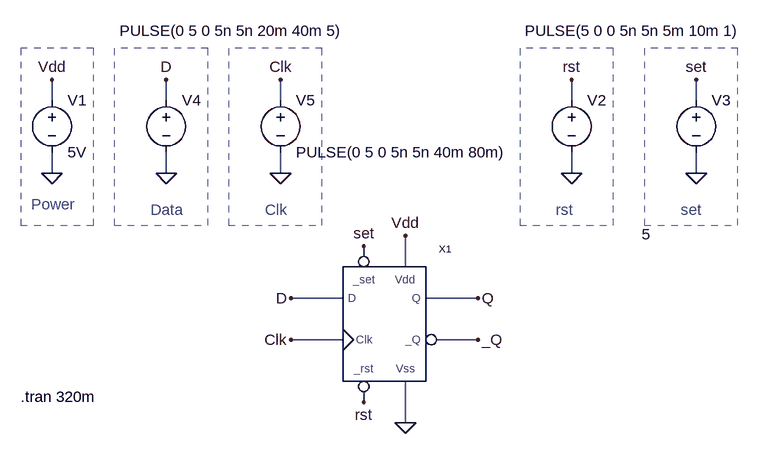
[diagram p0: schematic dff_p_w_asy_rst_set_block.asc]
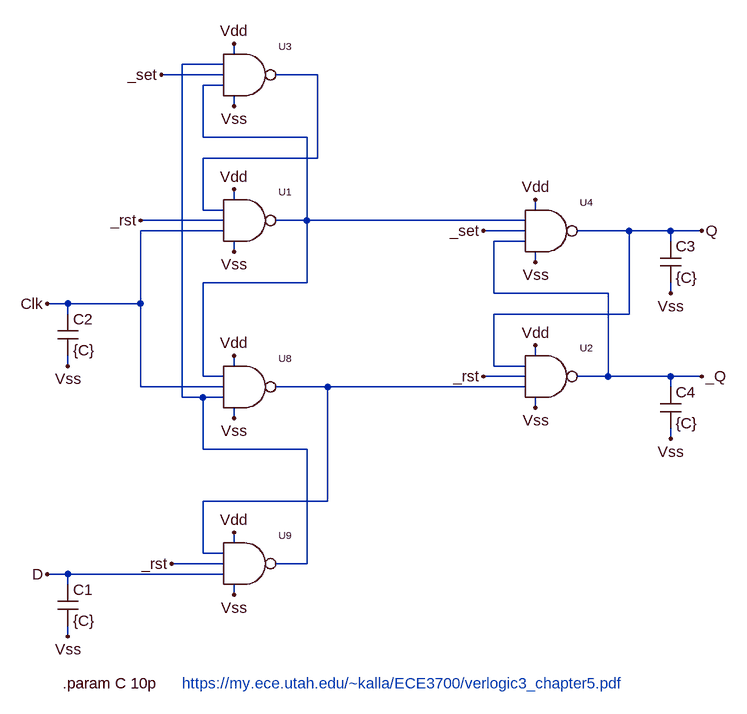
[diagram p1: sub-circuit dff_p_w_asy_rst_set.asc]
dff_p_w_asy_rst_set_block.asc, the LTspice schematic file:
Version 4
SHEET 1 896 680
WIRE -560 -416 -560 -448
WIRE -384 -416 -384 -448
WIRE -208 -416 -208 -448
WIRE 240 -416 240 -448
WIRE 432 -416 432 -448
WIRE -560 -304 -560 -336
WIRE -384 -304 -384 -336
WIRE -208 -304 -208 -336
WIRE 240 -304 240 -336
WIRE 432 -304 432 -336
WIRE -80 -176 -80 -192
WIRE -16 -160 -16 -208
WIRE -112 -112 -192 -112
WIRE 96 -112 16 -112
WIRE -112 -48 -192 -48
WIRE 96 -48 32 -48
WIRE -80 48 -80 32
WIRE -16 80 -16 16
FLAG 96 -112 Q
FLAG -192 -112 D
FLAG -16 -208 Vdd
FLAG -16 80 0
FLAG -560 -304 0
FLAG -560 -448 Vdd
FLAG -192 -48 Clk
FLAG 96 -48 _Q
FLAG -384 -304 0
FLAG -384 -448 D
FLAG -208 -304 0
FLAG -208 -448 Clk
FLAG 240 -304 0
FLAG 240 -448 rst
FLAG -80 48 rst
FLAG 432 -304 0
FLAG 432 -448 set
FLAG -80 -192 set
SYMBOL voltage -560 -432 R0
WINDOW 123 0 0 Left 0
WINDOW 39 0 0 Left 0
SYMATTR InstName V1
SYMATTR Value 5V
SYMBOL voltage -384 -432 R0
WINDOW 123 0 0 Left 0
WINDOW 39 0 0 Left 0
WINDOW 3 -72 -91 Left 2
SYMATTR Value PULSE(0 5 0 5n 5n 20m 40m 5)
SYMATTR InstName V4
SYMBOL voltage -208 -432 R0
WINDOW 123 0 0 Left 0
WINDOW 39 0 0 Left 0
SYMATTR InstName V5
SYMATTR Value PULSE(0 5 0 5n 5n 40m 80m)
SYMBOL voltage 240 -432 R0
WINDOW 123 0 0 Left 0
WINDOW 39 0 0 Left 0
WINDOW 3 -72 -91 Left 2
SYMATTR Value PULSE(5 0 0 5n 5n 5m 10m 1)
SYMATTR InstName V2
SYMBOL voltage 432 -432 R0
WINDOW 123 0 0 Left 0
WINDOW 39 0 0 Left 0
WINDOW 3 -84 222 Left 2
SYMATTR Value 5
SYMATTR InstName V3
SYMBOL dff_p_w_asy_rst_set -112 16 R0
SYMATTR InstName X1
TEXT -592 -256 Left 2 ;Power
TEXT -608 40 Left 2 !.tran 320m
TEXT -408 -248 Left 2 ;Data
TEXT -232 -248 Left 2 ;Clk
TEXT 216 -248 Left 2 ;rst
TEXT 408 -248 Left 2 ;set
RECTANGLE Normal -496 -496 -608 -224 2
RECTANGLE Normal -320 -496 -464 -224 2
RECTANGLE Normal -144 -496 -288 -224 2
RECTANGLE Normal 304 -496 160 -224 2
RECTANGLE Normal 496 -496 352 -224 2

dff_p_w_asy_rst_set.asc, the sub-circuit schematic file:
Version 4
SHEET 1 880 680
WIRE -464 -720 -464 -736
WIRE -480 -704 -544 -704
WIRE -480 -688 -576 -688
WIRE -336 -688 -400 -688
WIRE -480 -672 -512 -672
WIRE -464 -640 -464 -656
WIRE -512 -592 -512 -672
WIRE -352 -592 -512 -592
WIRE -336 -560 -336 -688
WIRE -336 -560 -512 -560
WIRE -464 -496 -464 -512
WIRE -512 -480 -512 -560
WIRE -480 -480 -512 -480
WIRE 0 -480 0 -496
WIRE -480 -464 -608 -464
WIRE -352 -464 -352 -592
WIRE -352 -464 -400 -464
WIRE -16 -464 -352 -464
WIRE -480 -448 -608 -448
WIRE -16 -448 -80 -448
WIRE 144 -448 64 -448
WIRE 208 -448 144 -448
WIRE 256 -448 208 -448
WIRE -16 -432 -64 -432
WIRE 208 -432 208 -448
WIRE -464 -416 -464 -432
WIRE 0 -400 0 -416
WIRE -352 -368 -352 -464
WIRE -352 -368 -512 -368
WIRE -64 -352 -64 -432
WIRE 112 -352 -64 -352
WIRE 208 -352 208 -368
WIRE -720 -336 -752 -336
WIRE -608 -336 -608 -448
WIRE -608 -336 -720 -336
WIRE -720 -320 -720 -336
WIRE 144 -320 144 -448
WIRE 144 -320 -64 -320
WIRE 0 -256 0 -272
WIRE -720 -240 -720 -256
WIRE -464 -240 -464 -256
WIRE -64 -240 -64 -320
WIRE -16 -240 -64 -240
WIRE -512 -224 -512 -368
WIRE -480 -224 -512 -224
WIRE -16 -224 -80 -224
WIRE 112 -224 112 -352
WIRE 112 -224 64 -224
WIRE 208 -224 112 -224
WIRE 256 -224 208 -224
WIRE -608 -208 -608 -336
WIRE -480 -208 -608 -208
WIRE -320 -208 -400 -208
WIRE -16 -208 -320 -208
WIRE 208 -208 208 -224
WIRE -544 -192 -544 -704
WIRE -512 -192 -544 -192
WIRE -480 -192 -512 -192
WIRE 0 -176 0 -192
WIRE -464 -160 -464 -176
WIRE 208 -128 208 -144
WIRE -512 -112 -512 -192
WIRE -352 -112 -512 -112
WIRE -320 -32 -320 -208
WIRE -320 -32 -512 -32
WIRE -464 32 -464 16
WIRE -512 48 -512 -32
WIRE -480 48 -512 48
WIRE -480 64 -560 64
WIRE -352 64 -352 -112
WIRE -352 64 -400 64
WIRE -720 80 -752 80
WIRE -480 80 -720 80
WIRE -720 96 -720 80
WIRE -464 112 -464 96
WIRE -720 176 -720 160
FLAG -464 16 Vdd
FLAG 0 -496 Vdd
FLAG -464 -256 Vdd
FLAG -464 -160 Vss
FLAG -464 112 Vss
FLAG 0 -400 Vss
FLAG -752 -336 Clk
FLAG -752 80 D
FLAG 256 -448 Q
FLAG 256 -224 _Q
FLAG -464 -736 Vdd
FLAG -464 -416 Vss
FLAG 0 -272 Vdd
FLAG -464 -640 Vss
FLAG -464 -512 Vdd
FLAG 0 -176 Vss
FLAG -720 -240 Vss
FLAG -720 176 Vss
FLAG 208 -128 Vss
FLAG 208 -352 Vss
FLAG -608 -464 _rst
FLAG -560 64 _rst
FLAG -80 -224 _rst
FLAG -576 -688 _set
FLAG -80 -448 _set
SYMBOL nand3 -480 -176 R0
SYMATTR InstName U8
SYMBOL cap -736 96 R0
SYMATTR InstName C1
SYMATTR Value {C}
SYMBOL cap -736 -320 R0
SYMATTR InstName C2
SYMATTR Value {C}
SYMBOL cap 192 -432 R0
SYMATTR InstName C3
SYMATTR Value {C}
SYMBOL cap 192 -208 R0
SYMATTR InstName C4
SYMATTR Value {C}
SYMBOL nand3 -480 -432 R0
SYMATTR InstName U1
SYMBOL nand3 -16 -192 R0
SYMATTR InstName U2
SYMBOL nand3 -480 96 R0
SYMATTR InstName U9
SYMBOL nand3 -480 -656 R0
SYMATTR InstName U3
SYMBOL nand3 -16 -416 R0
SYMATTR InstName U4
TEXT -728 248 Left 2 !.param C 10p
TEXT -544 248 Left 2 ;https://my.ece.utah.edu/~kalla/ECE3700/verlogic3_chapter5.pdf

The netlist it stands for:
* dff_p_w_asy_rst_set_block.asc
V1 Vdd 0 5V
V4 D 0 PULSE(0 5 0 5n 5n 20m 40m 5)
V5 Clk 0 PULSE(0 5 0 5n 5n 40m 80m)
V2 rst 0 PULSE(5 0 0 5n 5n 5m 10m 1)
V3 set 0 5
XX1 D Clk rst Q _Q Vdd 0 set dff_p_w_asy_rst_set

* block symbol definitions
.subckt dff_p_w_asy_rst_set D Clk _rst Q _Q Vdd Vss _set
XU8 N003 Clk N001 N004 Vdd Vss nand3  ; pins A B C Y Vdd Vss
C1 D Vss {C}
C2 Clk Vss {C}
C3 Q Vss {C}
C4 _Q Vss {C}
XU1 N002 _rst Clk N003 Vdd Vss nand3  ; pins A B C Y Vdd Vss
XU2 Q _rst N004 _Q Vdd Vss nand3  ; pins A B C Y Vdd Vss
XU9 N004 _rst D N001 Vdd Vss nand3  ; pins A B C Y Vdd Vss
XU3 N001 _set N003 N002 Vdd Vss nand3  ; pins A B C Y Vdd Vss
XU4 N003 _set _Q Q Vdd Vss nand3  ; pins A B C Y Vdd Vss
.param C 10p
* https://my.ece.utah.edu/~kalla/ECE3700/verlogic3_chapter5.pdf
.ends dff_p_w_asy_rst_set

* Power
.tran 320m
* Data
* Clk
* rst
* set
.backanno
.end